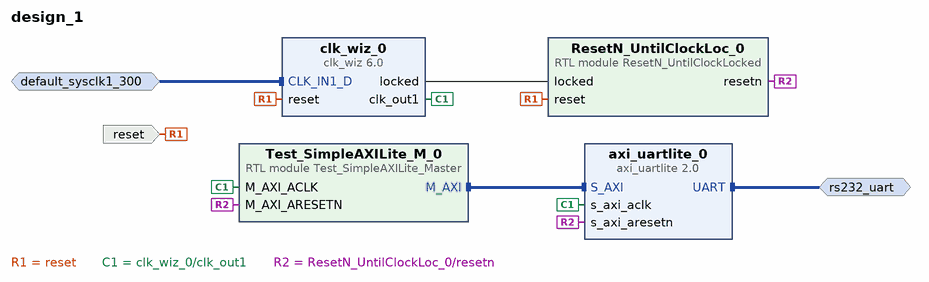
[diagram p0: block diagram of the top level]
# Vivado block design design_1, xcku5p-ffvb676-2-e, Vivado 2018.1
create_bd_design design_1

create_bd_intf_port -mode Master -vlnv xilinx.com:interface:uart_rtl:1.0 rs232_uart
create_bd_intf_port -mode Slave -vlnv xilinx.com:interface:diff_clock_rtl:1.0 default_sysclk1_300
set_property -dict {CONFIG.FREQ_HZ 300000000} [get_bd_intf_ports default_sysclk1_300]
create_bd_port -dir I -type rst reset
set_property -dict {CONFIG.POLARITY ACTIVE_HIGH} [get_bd_ports reset]

create_bd_cell -type ip -vlnv xilinx.com:ip:axi_uartlite:2.0 axi_uartlite_0
set_property -dict [list \
  CONFIG.C_BAUDRATE 921600 \
  CONFIG.C_S_AXI_ACLK_FREQ_HZ 300000000 \
  CONFIG.C_S_AXI_ACLK_FREQ_HZ_d 300.0 \
  CONFIG.PARITY Odd \
  CONFIG.C_USE_PARITY 1 \
  CONFIG.C_ODD_PARITY 1 \
  CONFIG.USE_BOARD_FLOW true \
  CONFIG.UARTLITE_BOARD_INTERFACE rs232_uart \
] [get_bd_cells axi_uartlite_0]
create_bd_cell -type ip -vlnv xilinx.com:ip:clk_wiz:6.0 clk_wiz_0
set_property -dict [list \
  CONFIG.CLKIN1_JITTER_PS 33.330000000000005 \
  CONFIG.CLKOUT1_REQUESTED_OUT_FREQ 300.000 \
  CONFIG.PRIM_SOURCE Differential_clock_capable_pin \
  CONFIG.MMCM_DIVCLK_DIVIDE 1 \
  CONFIG.MMCM_CLKFBOUT_MULT_F 4.000 \
  CONFIG.MMCM_CLKIN1_PERIOD 3.333 \
  CONFIG.MMCM_CLKIN2_PERIOD 10.0 \
  CONFIG.MMCM_CLKOUT0_DIVIDE_F 4.000 \
  CONFIG.USE_BOARD_FLOW true \
  CONFIG.CLK_IN1_BOARD_INTERFACE default_sysclk1_300 \
  CONFIG.RESET_BOARD_INTERFACE reset \
  CONFIG.CLKOUT1_JITTER 81.814 \
  CONFIG.CLKOUT1_PHASE_ERROR 77.836 \
] [get_bd_cells clk_wiz_0]
create_bd_cell -type module -reference ResetN_UntilClockLocked ResetN_UntilClockLoc_0
create_bd_cell -type module -reference Test_SimpleAXILite_Master Test_SimpleAXILite_M_0

# ---- connections ----

connect_bd_intf_net [get_bd_intf_pins Test_SimpleAXILite_M_0/M_AXI] [get_bd_intf_pins axi_uartlite_0/S_AXI]
connect_bd_intf_net [get_bd_intf_ports rs232_uart] [get_bd_intf_pins axi_uartlite_0/UART]
connect_bd_intf_net -intf_net default_sysclk1_300_1 [get_bd_intf_ports default_sysclk1_300] [get_bd_intf_pins clk_wiz_0/CLK_IN1_D]
connect_bd_net [get_bd_ports reset] [get_bd_pins clk_wiz_0/reset] [get_bd_pins ResetN_UntilClockLoc_0/reset]
connect_bd_net [get_bd_pins clk_wiz_0/clk_out1] [get_bd_pins axi_uartlite_0/s_axi_aclk] [get_bd_pins Test_SimpleAXILite_M_0/M_AXI_ACLK]
connect_bd_net [get_bd_pins ResetN_UntilClockLoc_0/resetn] \
  [get_bd_pins axi_uartlite_0/s_axi_aresetn] [get_bd_pins Test_SimpleAXILite_M_0/M_AXI_ARESETN]
connect_bd_net [get_bd_pins clk_wiz_0/locked] [get_bd_pins ResetN_UntilClockLoc_0/locked]

# ---- address map ----
assign_bd_address -offset 0x00000000 -range 4K -target_address_space [get_bd_addr_spaces Test_SimpleAXILite_M_0/M_AXI] [get_bd_addr_segs axi_uartlite_0/S_AXI/Reg]

validate_bd_design
save_bd_design
